# EAGLE design ble (EAGLE 6.1)
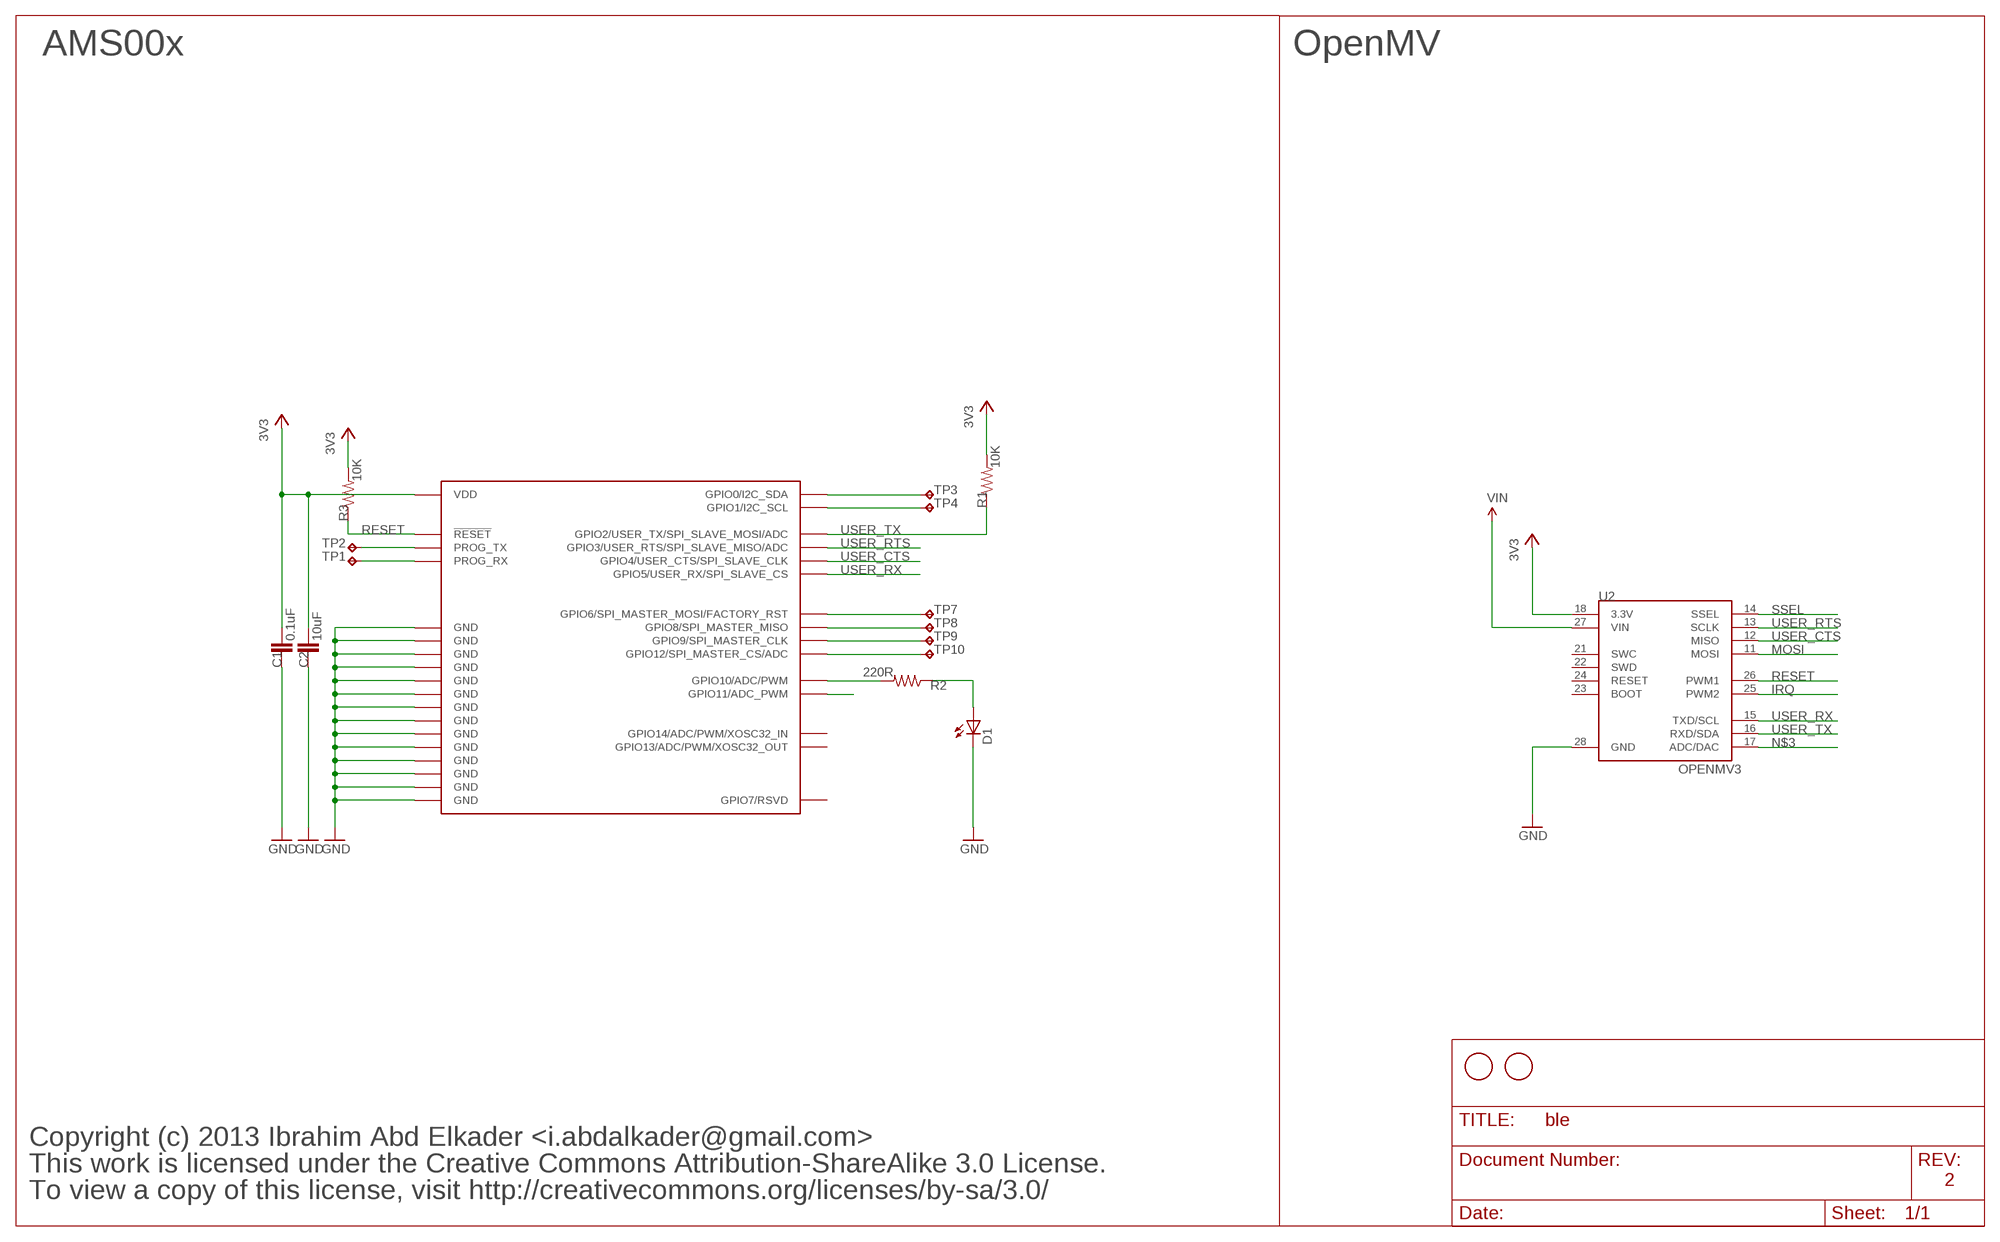
[diagram p0: schematic, sheet 1]

## Parts
C1  0.1uF  CAP0603-CAP  [0603-CAP]
C2  10uF  CAP0805  [0805]
D1  LED0603  [LED-0603]
R1  10K  RESISTOR0603-RES  [0603-RES]
R2  220R  RESISTOR0603-RES  [0603-RES]
R3  10K  RESISTOR0603-RES  [0603-RES]
TP1  TPTP12R  [TP12R]
TP2  TPTP12R  [TP12R]
TP3  TPTP12R  [TP12R]
TP4  TPTP12R  [TP12R]
TP7  TPTP12R  [TP12R]
TP8  TPTP12R  [TP12R]
TP9  TPTP12R  [TP12R]
TP10  TPTP12R  [TP12R]
U2  OPENMV3  [OPENMV3]
U$1  FIDUCIAL  [FIDUCIAL_1MM]
U$2  FIDUCIAL  [FIDUCIAL_1MM]
U$3  AMS00X  [AMS00X]

## Nets
3V3: C1.2 C2.2 R1.2 R3.2 U2.18(3.3V) U$3.P$21(VDD)
GND: C1.1 C2.1 D1.C U2.28(GND) U$3.P$1(GND) U$3.P$19(GND) U$3.P$22(GND) U$3.P$23(GND) U$3.P$24(GND) U$3.P$25(GND) U$3.P$26(GND) U$3.P$27(GND) U$3.P$28(GND) U$3.P$29(GND) U$3.P$30(GND) U$3.P$31(GND) U$3.P$32(GND) U$3.P$33(GND)
IRQ: U2.25(PWM2)
MOSI: U2.11(MOSI)
N$1: TP7.TP U$3.P$11(GPIO6/SPI_MASTER_MOSI/FACTORY_RST)
N$2: TP3.TP U$3.P$4(GPIO0/I2C_SDA)
N$3: U2.17(ADC/DAC)
N$4: TP4.TP U$3.P$5(GPIO1/I2C_SCL)
N$5: TP2.TP U$3.P$3(PROG_TX)
N$6: TP1.TP U$3.P$2(PROG_RX)
N$7: TP8.TP U$3.P$13(GPIO8/SPI_MASTER_MISO)
N$10: TP9.TP U$3.P$14(GPIO9/SPI_MASTER_CLK)
N$11: TP10.TP U$3.P$17(GPIO12/SPI_MASTER_CS/ADC)
N$13: U$3.P$16(GPIO11/ADC_PWM)
N$14: D1.A R2.1
N$15: R2.2 U$3.P$15(GPIO10/ADC/PWM)
RESET: R3.1 U2.26(PWM1) U$3.P$8(!RESET)
SSEL: U2.14(SSEL)
USER_CTS: U2.12(MISO) U$3.P$9(GPIO4/USER_CTS/SPI_SLAVE_CLK)
USER_RTS: U2.13(SCLK) U$3.P$7(GPIO3/USER_RTS/SPI_SLAVE_MISO/ADC)
USER_RX: U2.15(TXD/SCL) U$3.P$10(GPIO5/USER_RX/SPI_SLAVE_CS)
USER_TX: R1.1 U2.16(RXD/SDA) U$3.P$6(GPIO2/USER_TX/SPI_SLAVE_MOSI/ADC)
VIN: U2.27(VIN)
Unconnected: U2.21(SWC) U2.22(SWD) U2.23(BOOT) U2.24(RESET) U$3.P$12(GPIO7/RSVD) U$3.P$18(GPIO13/ADC/PWM/XOSC32_OUT) U$3.P$20(GPIO14/ADC/PWM/XOSC32_IN)

## Notes on the sheet
- AMS00x | OpenMV
- Copyright (c) 2013 Ibrahim Abd Elkader <i.abdalkader@gmail.com>
- This work is licensed under the Creative Commons Attribution-ShareAlike 3.0 License.
- 2
- To view a copy of this license, visit http://creativecommons.org/licenses/by-sa/3.0/

## Library data of the parts
C1 C2 = sfe:CAP: Capacitor Standard 0603 ceramic capacitor, and 0.1" leaded capacitor.
D1 = sfe:LED: LEDs Standard schematic elements and footprints for 5mm, 3mm, 1206, and 0603 sized LEDs. 5mm - Spark Fun Electronics SKU : COM-00529 (and others)
R1-R3 = sfe:RESISTOR: Resistor Basic schematic elements and footprints for 0603, 1206, and PTH resistors.
TP1-TP4 TP7-TP10 = testpad:TP: Test pad
U2 = openmv:OPENMV3
U$1 U$2 = adafruit:FIDUCIAL: For use by pick and place machines to calibrate the vision/machine, 1mm By microbuilder.eu
U$3 = AMS:AMS00X

## Net classes
1 vcc: width 1.016 mm, clearance 0.203 mm
2 antenna: width 0.363 mm, clearance 0.305 mm
3 1.8v: width 0.457 mm, clearance 0.254 mm

## Board
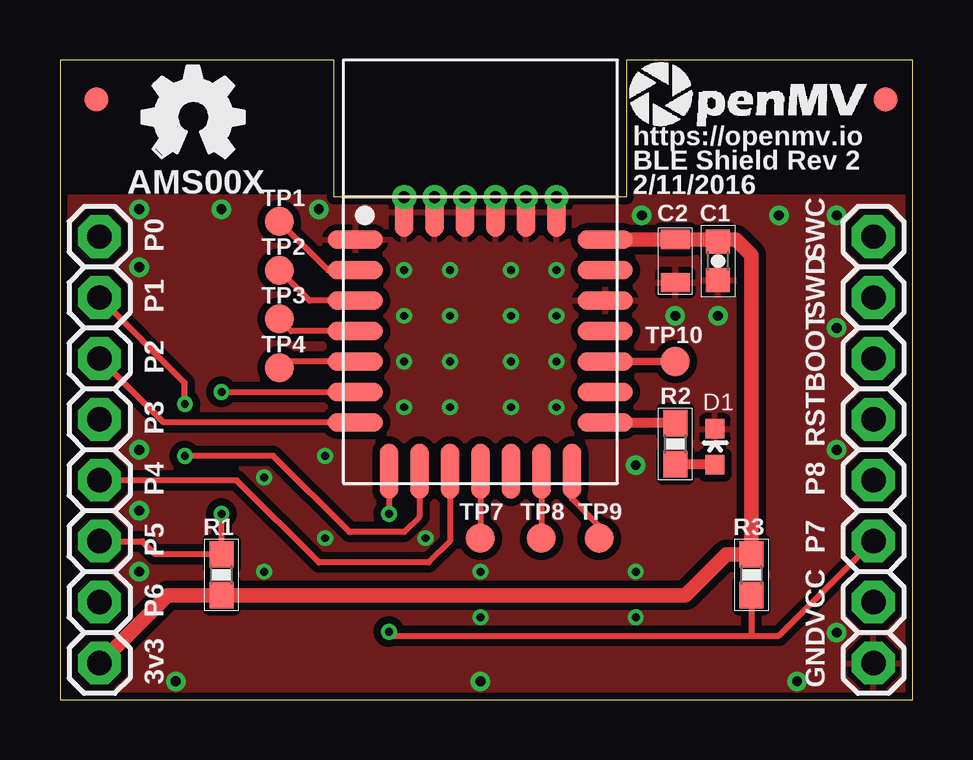
[diagram p1: board, top side]
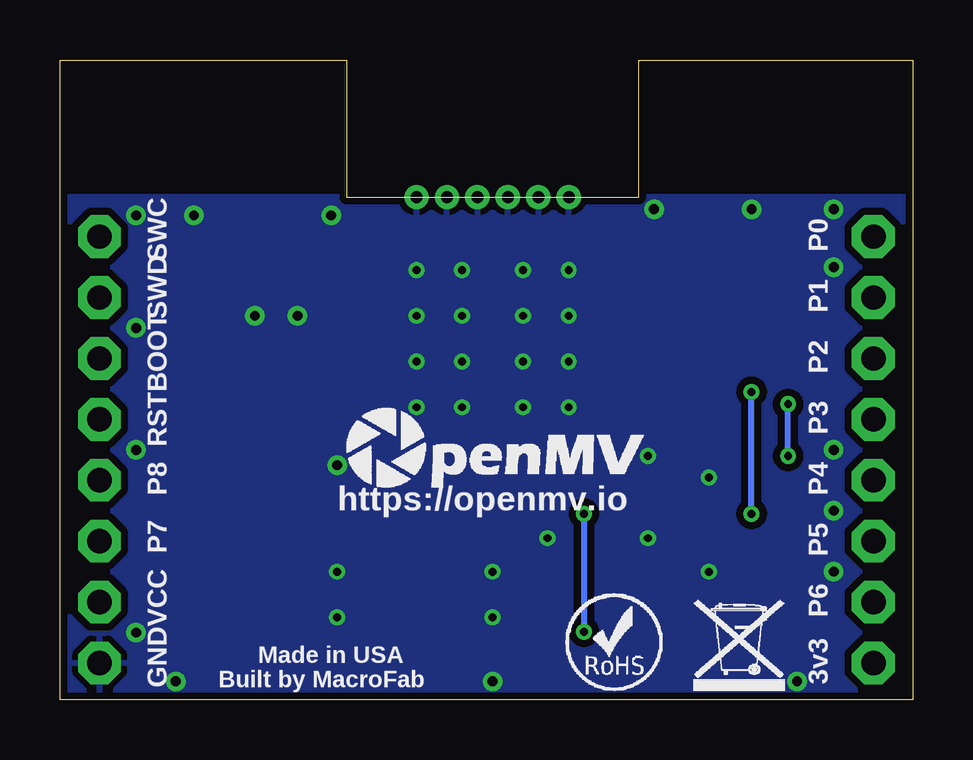
[diagram p2: board, bottom side, seen from below]

Size 35.56 x 26.67 mm. Coordinates in mm from the lower left corner, seen from the top.
Outline: 0,0 35.56,0 35.56,26.67 23.62,26.67 23.62,20.95 11.43,20.95 11.43,26.67 0,26.67 0,0
Copper layers (1*16): Top 0.035mm / dielectric 1.5mm / Bottom 0.035mm
Design rules: minimum track width 8mil, minimum drill 13mil, track to track 6mil, track to pad 6mil, pad to pad 6mil, via to via 6mil, smd to smd 6mil, copper to edge 5mil, drill to drill 10mil, minimum pad ring 10mil, minimum via ring 4mil, stop-mask expansion 2mil, vias tented up to drill 40mil, thermal gap 10mil

### Footprints (pad centres in the part's own frame; a part is rotated, then mirrored left to right if it is on the bottom)
0603-CAP = smd 1 x 1: 1 -0.8,0; 2 0.8,0
0805 = smd 0.8 x 1.2: 1 -0.9,0; 2 0.9,0
LED-0603 = smd 0.8 x 0.8: A 0,-0.75; C 0,0.75
0603-RES = smd 1.1 x 1: 1 -0.85,0; 2 0.85,0
TP12R = smd 1.2 x 1.2: TP 0,0
OPENMV3 = drill 1.016 pad 1.778 octagon: 11 1.651,19.304; 12 1.651,16.764; 13 1.651,14.224; 14 1.651,11.684; 15 1.651,9.144; 16 1.651,6.604; 17 1.651,4.064; 18 1.651,1.524; 21 33.909,19.304; 22 33.909,16.764; 23 33.909,14.224; 24 33.909,11.684; 25 33.909,9.144; 26 33.909,6.604; 27 33.909,4.064; 28 33.909,1.524
FIDUCIAL_1MM = smd 1 x 1: 1 0,0
AMS00X = smd 2.286 x 0.762: P$1 0.508,10.16; P$2 0.508,8.89; P$3 0.508,7.62; P$4 0.508,6.35; P$5 0.508,5.08; P$6 0.508,3.81; P$7 0.508,2.54; P$15 10.922,2.54; P$16 10.922,3.81; P$17 10.922,5.08; P$18 10.922,6.35; P$19 10.922,7.62; P$20 10.922,8.89; P$21 10.922,10.16 | smd 0.762 x 2.286: P$8 1.905,0.508; P$9 3.175,0.508; P$10 4.445,0.508; P$11 5.715,0.508; P$12 6.985,0.508; P$13 8.255,0.508; P$14 9.525,0.508 | smd 0.762 x 2.032: P$22 8.89,11.303; P$23 7.62,11.303; P$24 6.35,11.303; P$25 5.08,11.303; P$26 3.81,11.303; P$27 2.54,11.303 | drill 0.5 pad 1: P$28 8.89,11.938; P$29 7.62,11.938; P$30 6.35,11.938; P$31 5.08,11.938; P$32 3.81,11.938; P$33 2.54,11.938

### Placement (x,y rotation side)
C1  27.43,18.29 90 top
C2  25.65,18.29 90 top
D1  27.3,10.54 0 top
R1  6.73,5.21 270 top
R2  25.65,10.67 90 top
R3  28.83,5.21 90 top
TP1  9.14,19.94 0 top
TP2  9.14,17.91 0 top
TP3  9.14,15.88 0 top
TP4  9.14,13.84 0 top
TP7  17.53,6.73 0 top
TP8  20.07,6.73 0 top
TP9  22.48,6.73 0 top
TP10  25.65,14.1 0 top
U2  0,0 0 top
U$1  1.52,25.02 0 top
U$2  34.42,25.02 0 top
U$3  11.81,9.02 0 top
U$4  [OMV-LOGO]  23.75,8.64 0 bottom
U$5  [OSHW_FILLX150_NOTEXT]  3.43,22.61 0 top
U$7  [OMV-LOGO-SMALL]  23.62,23.75 0 top
U$8  [WEEE]  9.14,0.38 0 bottom
U$9  [ROHS]  14.48,0.38 0 bottom

### Tracks (layer width: path | path; a pad name or v marks a point on that pad's centre or on a via)
3V3
  Top 0.61: U2.18 4.48,4.36 R1.2 26.07,4.36 27.77,6.06 R3.2 28.83,18.54 28.18,19.19 27.53,19.19 | 27.53,19.19 C2.2 22.74,19.19 U$3.P$21 | 27.53,19.19 C1.2
GND  (via drill 0.33, 0.41)
  other vias: 4.83,0.76 17.53,0.76 20.7,17.91 20.7,16 20.7,14.1 20.7,12.19 18.8,17.91 16.26,17.91 14.35,17.91 16.26,16 14.35,16 18.8,14.1 16.26,14.1 14.35,14.1 18.8,12.19 16.26,12.19 14.35,12.19 27.43,16 25.65,16 18.8,16 3.3,10.41 3.3,7.87 3.3,5.33 32.38,2.79 24,9.78 3.3,18.03 15.24,6.73 10.79,20.45 32.38,10.41 32.38,15.49 11.05,6.73 11.05,10.16 8.51,9.27 8.51,5.33 6.73,20.45 3.3,20.45 32.38,20.19 24.26,20.19 29.97,20.19 30.73,0.76 17.53,5.33 24,5.33 24,3.43 17.53,3.43
  pour Top (isolate 0.305, rank 2): 0,0 0,20.95 35.56,20.95 35.56,0
  pour Bottom (isolate 0.305, rank 2): 0,0 0,20.95 35.56,20.95 35.56,0
N$1
  Top 0.254: U$3.P$11 TP7.TP
N$2
  Top 0.254: U$3.P$4 9.65,15.37 TP3.TP
N$4
  Top 0.254: U$3.P$5 9.4,14.1 TP4.TP
N$5
  Top 0.254: U$3.P$3 10.41,16.64 TP2.TP
N$6
  Top 0.254: U$3.P$2 11.18,17.91 TP1.TP
N$7
  Top 0.254: U$3.P$13 TP8.TP
N$10
  Top 0.254: U$3.P$14 21.34,8.38 22.48,7.24 TP9.TP
N$11
  Top 0.305: U$3.P$17 TP10.TP
N$14
  Top 0.406: R2.1 27.3,9.82 D1.A
N$15
  Top 0.406: U$3.P$15 25.65,11.56 R2.2
RESET  (via drill 0.33)
  Top 0.254: U$3.P$8 v13.72,7.75 | 28.83,2.67 13.88,2.67 v13.72,2.83 | 28.83,2.67 29.97,2.67 U2.26 | R3.1 28.83,2.67
  Bottom 0.254: v13.72,7.75 v13.72,2.83
USER_CTS  (via drill 0.33)
  Top 0.254: U$3.P$9 14.99,7.62 14.35,6.99 12.06,6.99 8.89,10.16 v5.21,10.16 | v5.21,12.32 5.21,13.21 U2.12
  Bottom 0.254: v5.21,10.16 v5.21,12.32
USER_RTS
  Top 0.254: U$3.P$7 4.32,11.56 U2.13
USER_RX
  Top 0.254: U$3.P$10 16.26,6.6 15.37,5.71 10.79,5.71 7.37,9.14 U2.15
USER_TX  (via drill 0.33)
  Top 0.254: v6.73,12.83 U$3.P$6 | v6.73,7.75 R1.1 3.98,6.06 3.43,6.6 U2.16
  Bottom 0.254: v6.73,7.75 v6.73,12.83

### Text on the board
tPlace: https://openmv.io | BLE Shield Rev 2 | AMS00X | 2/11/2016 | P0 | SWC | P1 | SWD | P2 | BOOT | P3 | RST | P4 | P8 | P5 | P7 | P6 | VCC | 3v3 | GND
bPlace: P0 | SWC | P1 | SWD | P2 | BOOT | P3 | RST | P4 | P8 | https://openmv.io | P5 | P7 | P6 | VCC | Made in USA | 3v3 | Built by MacroFab | GND